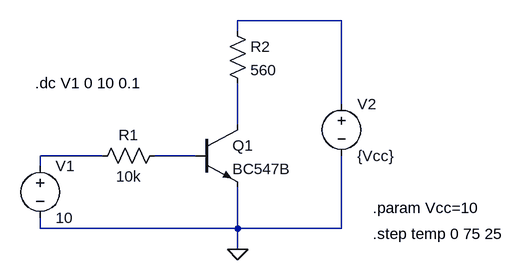
[diagram p0: schematic polarizacion juntura BE variando temperatura.asc]
polarizacion juntura BE variando temperatura.asc, the LTspice schematic file:
Version 4.1
SHEET 1 880 680
WIRE 448 -80 288 -80
WIRE 288 -64 288 -80
WIRE 448 48 448 -80
WIRE 288 80 288 16
WIRE 80 128 -16 128
WIRE 224 128 160 128
WIRE -16 144 -16 128
WIRE -16 240 -16 224
WIRE 288 240 288 176
WIRE 288 240 -16 240
WIRE 448 240 448 128
WIRE 448 240 288 240
WIRE 288 272 288 240
FLAG 288 272 0
SYMBOL voltage -16 128 R0
WINDOW 123 0 0 Left 0
WINDOW 39 0 0 Left 0
SYMATTR InstName V1
SYMATTR Value 10
SYMBOL res 64 144 R270
WINDOW 0 32 56 VTop 2
WINDOW 3 0 56 VBottom 2
SYMATTR InstName R1
SYMATTR Value 10k
SYMBOL npn 224 80 R0
SYMATTR InstName Q1
SYMATTR Value BC547B
SYMBOL res 272 -80 R0
SYMATTR InstName R2
SYMATTR Value 560
SYMBOL voltage 448 32 R0
WINDOW 123 0 0 Left 0
WINDOW 39 0 0 Left 0
SYMATTR InstName V2
SYMATTR Value {Vcc}
TEXT -24 16 Left 2 !.dc V1 0 10 0.1
TEXT 496 208 Left 2 !.param Vcc=10
TEXT 496 248 Left 2 !.step temp 0 75 25

The netlist it stands for:
* polarizacion juntura BE variando temperatura.asc
V1 N003 0 10
R1 N003 N004 10k
Q1 N002 N004 0 0 BC547B
R2 N001 N002 560
V2 N001 0 {Vcc}
.model NPN NPN
.model PNP PNP
.lib standard.bjt
.dc V1 0 10 0.1
.param Vcc=10
.step temp 0 75 25
.backanno
.end